# EasyEDA schematic SCH_RAK_Power_module_2023-06-18.json
TITLE: Sheet_1; REV: 1.0; Date: 2023-06-18; Sheet: 1/1; Drawn By: pierluigi colangeli; Company: Your Company
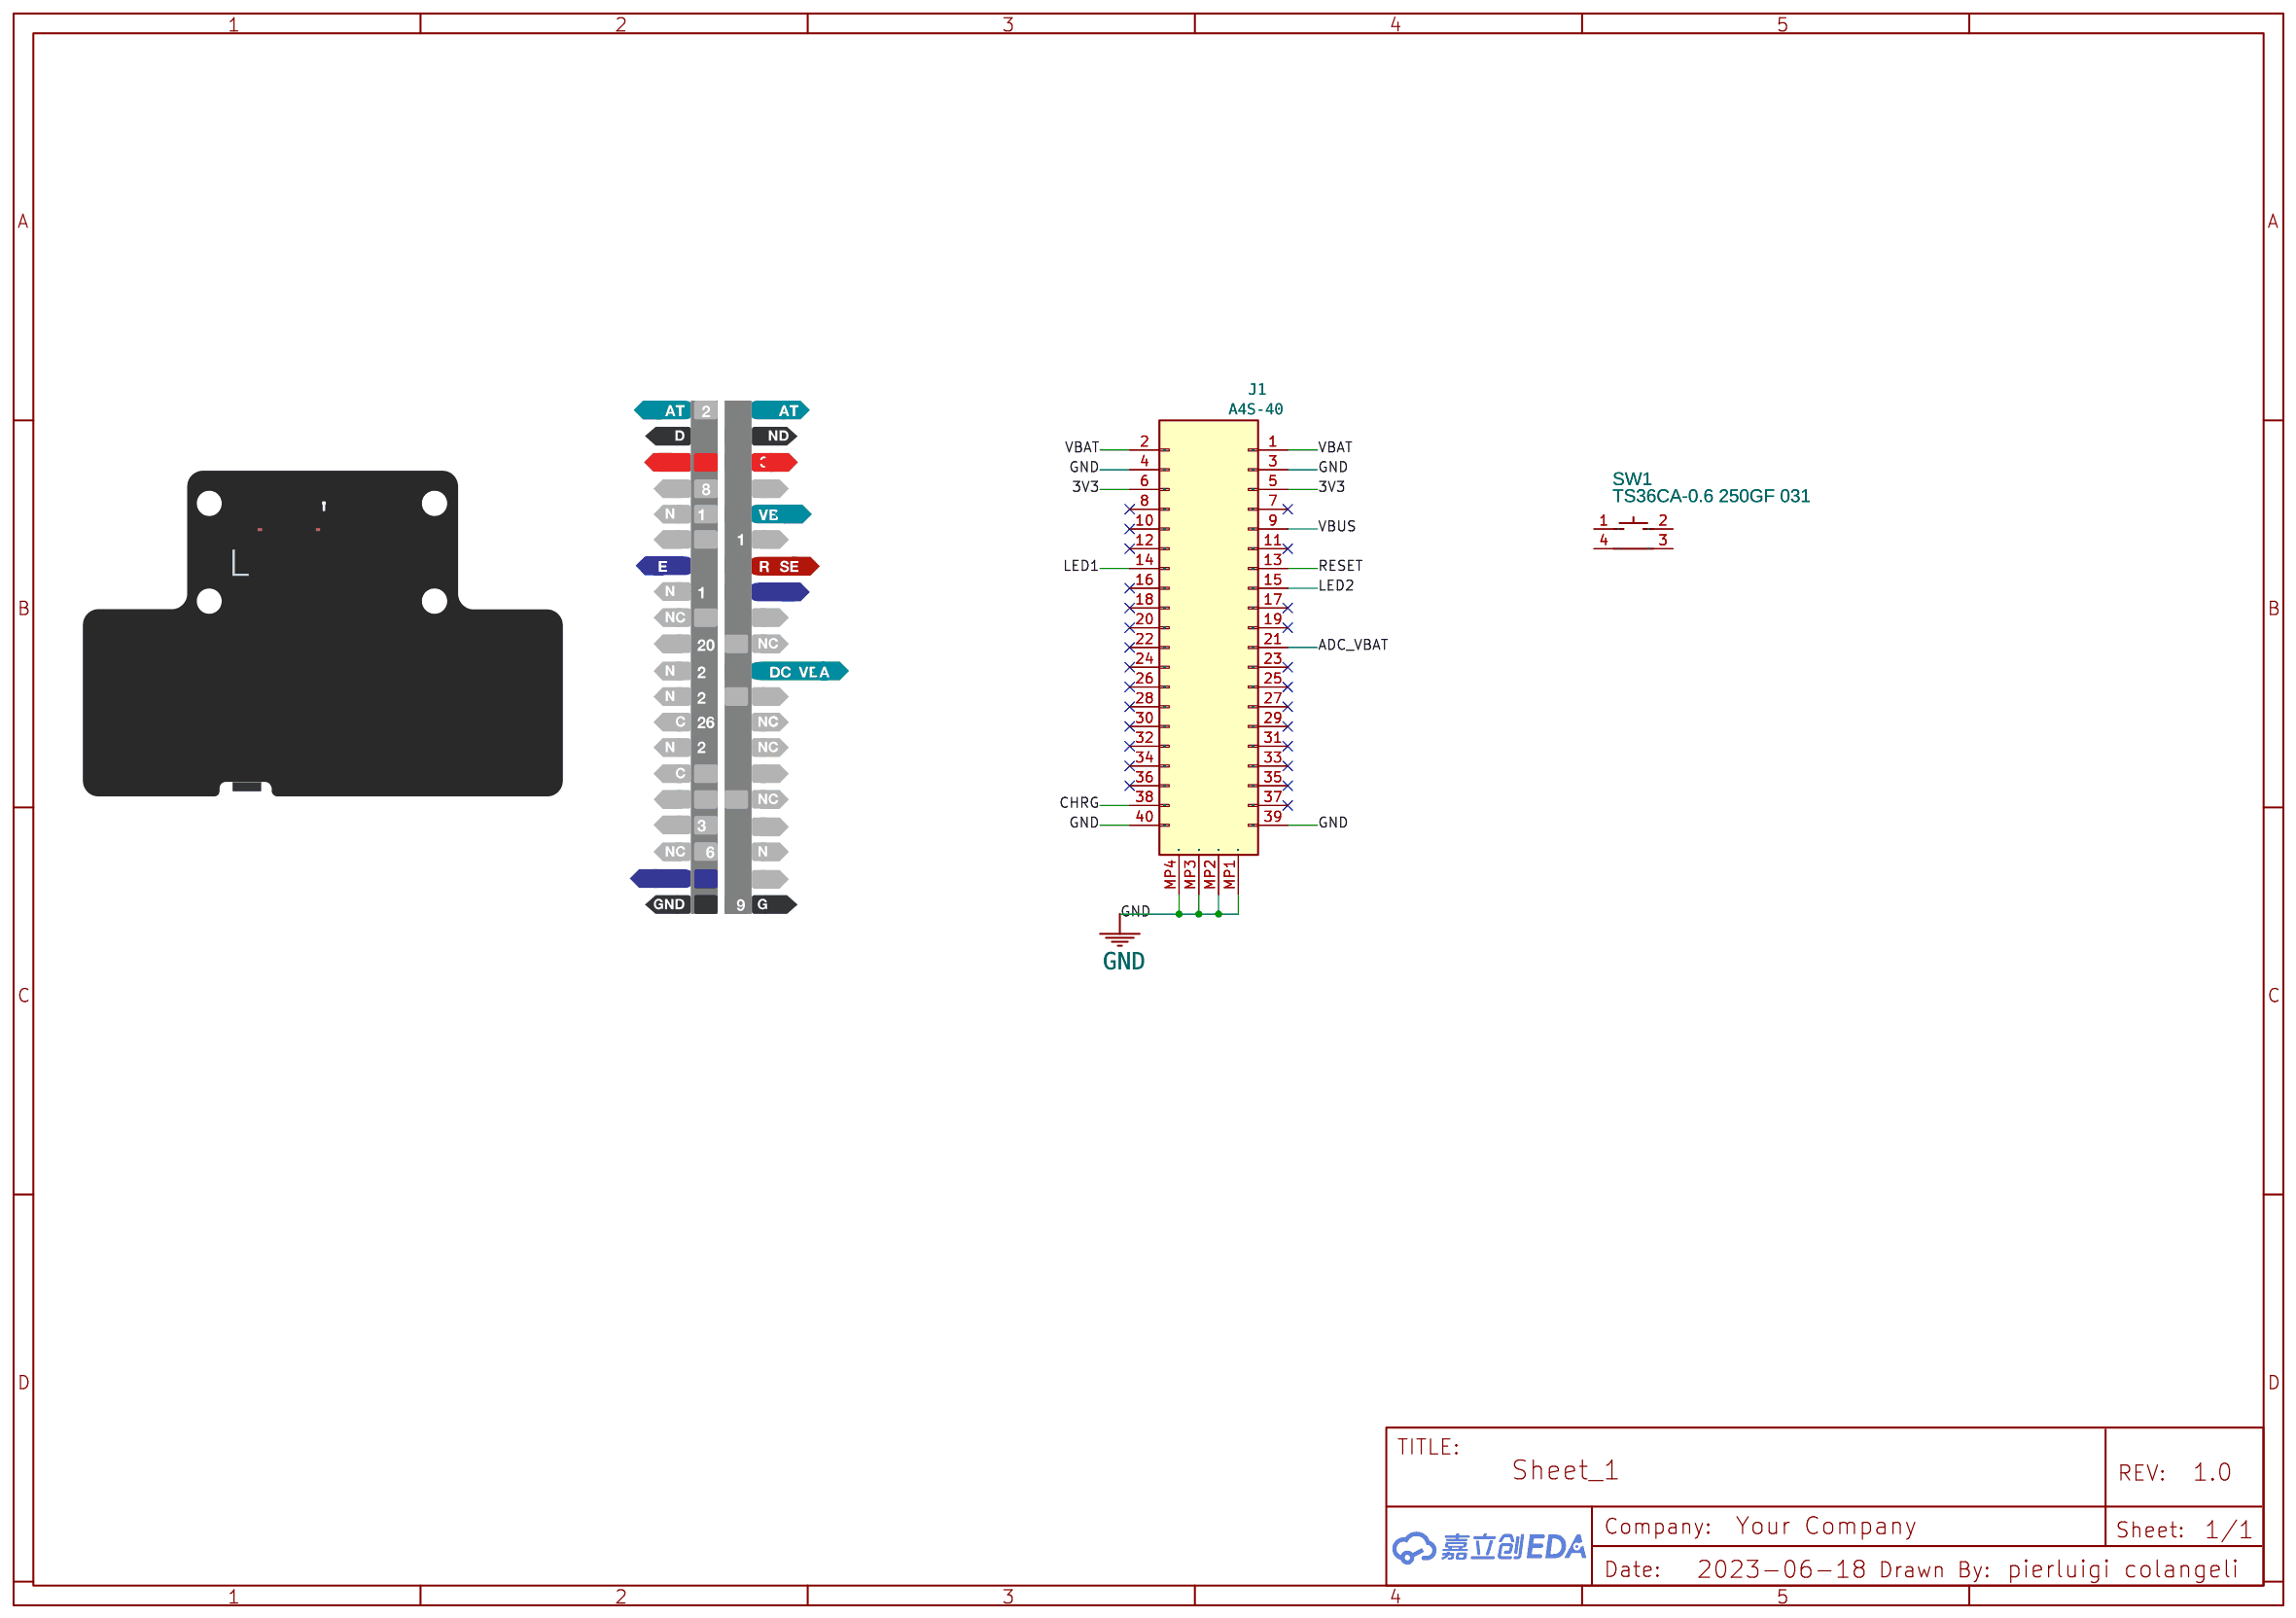
[diagram p0: schematic sheet]

## Parts
J1  A4S-40  [A4S-40]
SW1  TS36CA-0.6 250GF 031  [SW-SMD_SHOU_TS36CA-0.6]

## Library data of the parts
SW1 = TS36CA-0.6 250GF 031: Supplier: LCSC; Supplier Part: C2906288; Manufacturer: SHOU HAN(首韩); Manufacturer Part: TS36CA-0.6 250gf 031; Contributor: LCSC; JLCPCB Part Class: Extended Part

## Nets
3V3: J1.5(Pin) J1.6(Pin)
GND: J1.3(Pin) J1.4(Pin) J1.39(Pin) J1.40(Pin) J1.MP1 J1.MP2 J1.MP3 J1.MP4
VBAT: J1.1(Pin) J1.2(Pin)
VBUS: J1.9(Pin)
ADC_VBAT: J1.21(Pin)
CHRG: J1.38(Pin)
LED1: J1.14(Pin)
LED2: J1.15(Pin)
RESET: J1.13(Pin)

Not connected (* = marked no-connect by the designer): J1 7(Pin)* 8(Pin)* 10(Pin)* 11(Pin)* 12(Pin)* 16(Pin)* 17(Pin)* 18(Pin)* 19(Pin)* 20(Pin)* 22(Pin)* 23(Pin)* 24(Pin)* 25(Pin)* 26(Pin)* 27(Pin)* 28(Pin)* 29(Pin)* 30(Pin)* 31(Pin)* 32(Pin)* 33(Pin)* 34(Pin)* 35(Pin)* 36(Pin)* 37(Pin)*; SW1 1 2 3 4
